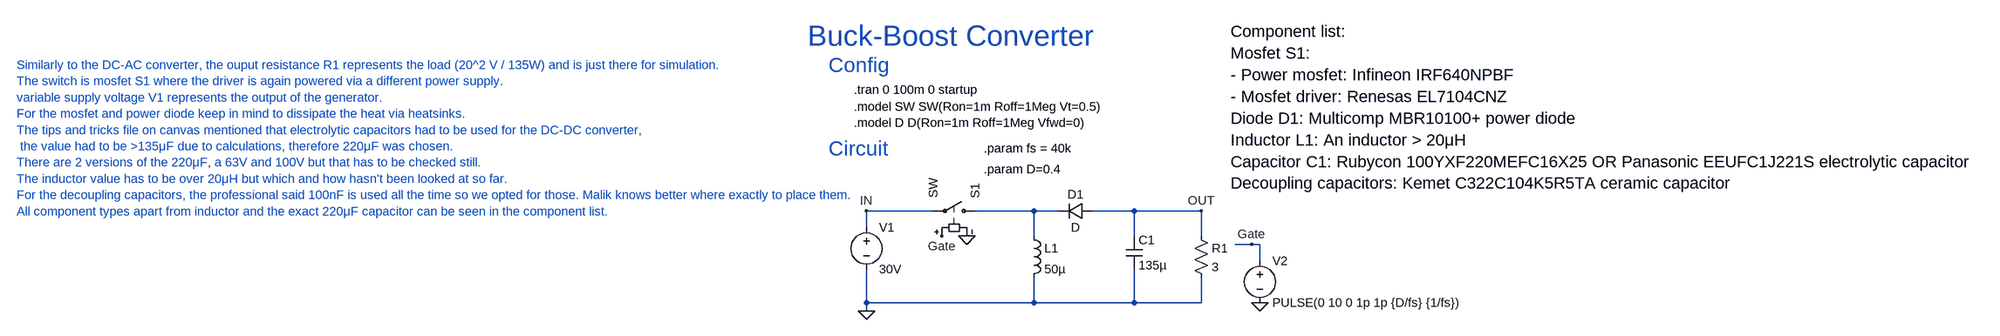
[diagram p0: schematic Buck-BoostConverter_with_explaination.asc]
Buck-BoostConverter_with_explaination.asc, the LTspice schematic file:
Version 4
SHEET 1 3572 848
WIRE 560 32 432 32
WIRE 752 32 640 32
WIRE 800 32 752 32
WIRE 944 32 864 32
WIRE 1072 32 944 32
WIRE 432 64 432 32
WIRE 752 80 752 32
WIRE 944 80 944 32
WIRE 1072 80 1072 32
WIRE 1168 96 1136 96
WIRE 1184 96 1168 96
WIRE 1184 128 1184 96
WIRE 432 208 432 144
WIRE 752 208 752 160
WIRE 752 208 432 208
WIRE 944 208 944 144
WIRE 944 208 752 208
WIRE 1072 208 1072 160
WIRE 1072 208 944 208
WIRE 432 224 432 208
FLAG 432 224 0
FLAG 576 80 Gate
FLAG 624 80 0
FLAG 432 32 IN
FLAG 1072 32 OUT
FLAG 1168 96 Gate
FLAG 1184 208 0
SYMBOL voltage 432 48 R0
WINDOW 123 0 0 Left 2
WINDOW 39 0 0 Left 2
SYMATTR InstName V1
SYMATTR Value 30V
SYMBOL cap 928 80 R0
SYMATTR InstName C1
SYMATTR Value 135µ
SYMBOL diode 864 16 R90
WINDOW 0 0 32 VBottom 2
WINDOW 3 32 32 VTop 2
SYMATTR InstName D1
SYMBOL res 1056 64 R0
SYMATTR InstName R1
SYMATTR Value 3
SYMBOL ind 736 64 R0
SYMATTR InstName L1
SYMATTR Value 50µ
SYMBOL sw 656 32 M270
SYMATTR InstName S1
SYMBOL voltage 1184 112 R0
WINDOW 123 0 0 Left 0
WINDOW 39 0 0 Left 0
SYMATTR InstName V2
SYMATTR Value PULSE(0 10 0 1p 1p {D/fs} {1/fs})
TEXT 408 -200 Left 2 !.tran 0 100m 0 startup
TEXT 408 -168 Left 2 !.model SW SW(Ron=1m Roff=1Meg Vt=0.5)\n.model D D(Ron=1m Roff=1Meg Vfwd=0)
TEXT 360 -248 Left 4 ;Config
TEXT 320 -304 Left 5 ;Buck-Boost Converter
TEXT 360 -88 Left 4 ;Circuit
TEXT 656 -88 Left 2 !.param fs = 40k
TEXT 656 -48 Left 2 !.param D=0.4
TEXT 1128 -312 Left 3 !Component list:\nMosfet S1: \n- Power mosfet: Infineon IRF640NPBF  \n- Mosfet driver: Renesas EL7104CNZ \nDiode D1: Multicomp MBR10100+ power diode \nInductor L1: An inductor > 20μH\nCapacitor C1: Rubycon 100YXF220MEFC16X25 OR Panasonic EEUFC1J221S electrolytic capacitor\nDecoupling capacitors: Kemet C322C104K5R5TA ceramic capacitor
TEXT -1192 -248 Left 2 ;Similarly to the DC-AC converter, the ouput resistance R1 represents the load (20^2 V / 135W) and is just there for simulation.\nThe switch is mosfet S1 where the driver is again powered via a different power supply.\nvariable supply voltage V1 represents the output of the generator.\nFor the mosfet and power diode keep in mind to dissipate the heat via heatsinks.\nThe tips and tricks file on canvas mentioned that electrolytic capacitors had to be used for the DC-DC converter,\n the value had to be >135μF due to calculations, therefore 220μF was chosen. \nThere are 2 versions of the 220μF, a 63V and 100V but that has to be checked still.\nThe inductor value has to be over 20μH but which and how hasn't been looked at so far. \nFor the decoupling capacitors, the professional said 100nF is used all the time so we opted for those. Malik knows better where exactly to place them.\nAll component types apart from inductor and the exact 220μF capacitor can be seen in the component list.

The netlist it stands for:
* Buck-BoostConverter_with_explaination.asc
V1 IN 0 30V
C1 OUT 0 135µ
D1 OUT N001 D
R1 OUT 0 3
L1 N001 0 50µ
S1 N001 IN Gate 0 SW
V2 Gate 0 PULSE(0 10 0 1p 1p {D/fs} {1/fs})
.model D D
.lib standard.dio
.tran 0 100m 0 startup
.model SW SW(Ron=1m Roff=1Meg Vt=0.5)
.model D D(Ron=1m Roff=1Meg Vfwd=0)
* Config
* Buck-Boost Converter
* Circuit
.param fs = 40k
.param D=0.4
Component list:
Mosfet S1:
- Power mosfet: Infineon IRF640NPBF
- Mosfet driver: Renesas EL7104CNZ
Diode D1: Multicomp MBR10100+ power diode
Inductor L1: An inductor > 20μH
Capacitor C1: Rubycon 100YXF220MEFC16X25 OR Panasonic EEUFC1J221S electrolytic capacitor
Decoupling capacitors: Kemet C322C104K5R5TA ceramic capacitor
* Similarly to the DC-AC converter, the ouput resistance R1 represents the load (20^2 V / 135W) and is just there for simulation.
* The switch is mosfet S1 where the driver is again powered via a different power supply.
* variable supply voltage V1 represents the output of the generator.
* For the mosfet and power diode keep in mind to dissipate the heat via heatsinks.
* The tips and tricks file on canvas mentioned that electrolytic capacitors had to be used for the DC-DC converter,
*  the value had to be >135μF due to calculations, therefore 220μF was chosen.
* There are 2 versions of the 220μF, a 63V and 100V but that has to be checked still.
* The inductor value has to be over 20μH but which and how hasn't been looked at so far.
* For the decoupling capacitors, the professional said 100nF is used all the time so we opted for those. Malik knows better where exactly to place them.
* All component types apart from inductor and the exact 220μF capacitor can be seen in the component list.
.backanno
.end